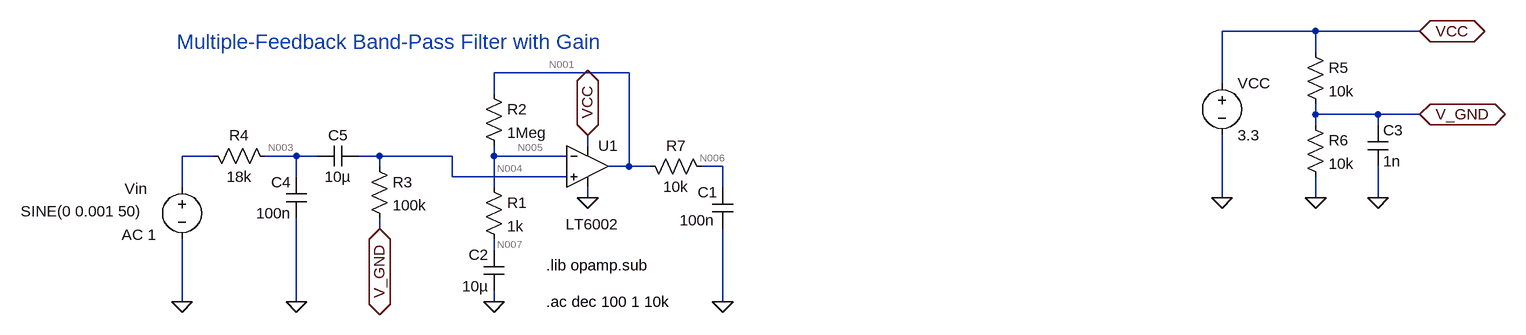
[diagram p0: schematic MF_bandpass.asc]
* MF_bandpass.asc
Vin N002 0 SINE(0 0.001 50) AC 1
R4 N003 N002 18k
C4 0 N003 100n
* U1: LT6002 (symbol Opamps\LT6002 not available, pins judged from their places): In+=N004 In-=N005 V+=VCC V-=0 OUT=N001
VCC VCC 0 3.3
R5 VCC V_GND 10k
R6 V_GND 0 10k
C3 V_GND 0 1n
C5 N004 N003 10µ
R1 N005 N007 1k
R2 N001 N005 1Meg
R7 N006 N001 10k
C1 0 N006 100n
R3 N004 V_GND 100k
C2 0 N007 10µ
.lib opamp.sub
.ac dec 100 1 10k
* Multiple-Feedback Band-Pass Filter with Gain
.backanno
.end

* Results of the author's LTspice run, read from the files saved beside the schematic
* Operating Point, zero values left out:
*   V(n005) = 1.65 V
*   V(n004) = 1.65 V
*   V(n001) = 1.648 V
*   V(vcc) = 3.3 V
*   V(v_gnd) = 1.65 V
*   V(n007) = 1.65 V
*   V(n006) = 1.648 V
*   I(R3) = 2.07 nA
*   I(R2) = -2.07 nA
*   I(R6) = 165 µA
*   I(R5) = 165 µA
*   I(Vcc) = -178 µA
*   Ix(u1:1) = -2.07 nA
*   Ix(u1:2) = -2.07 nA
*   Ix(u1:3) = 13 µA
*   Ix(u1:4) = -12.99 µA
*   Ix(u1:5) = 2.07 nA
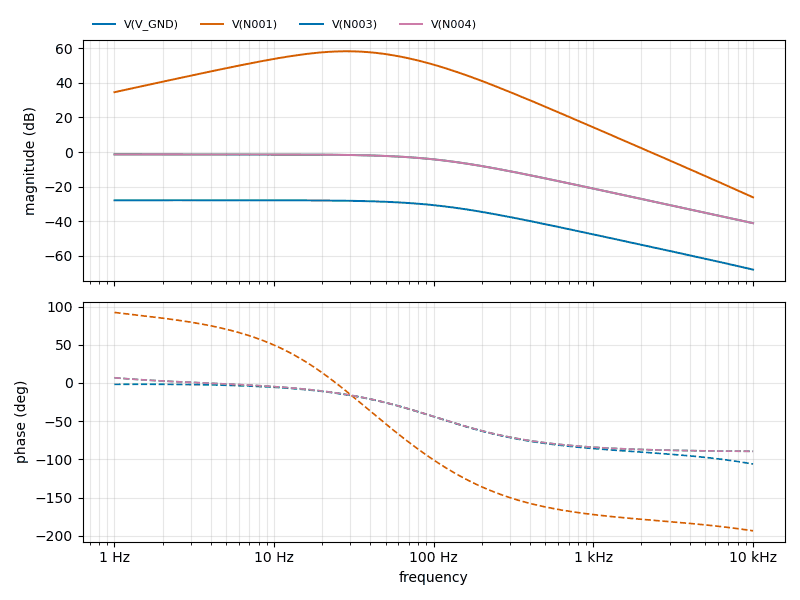
[diagram p1: AC Analysis of MF_bandpass.asc, plotted from the saved traces]
* AC Analysis, 1 run:
*   V(V_GND): -27.89 dB at 1 Hz, -67.89 dB at 10 kHz, peak -27.83 dB at 3.631 Hz, 3 dB below the peak at 103.8 Hz
*   V(N001): 34.52 dB at 1 Hz, -26.19 dB at 10 kHz, peak 58.15 dB at 28.18 Hz, 3 dB below the peak at 12.31 Hz and 61.24 Hz
*   V(N003): -1.35 dB at 1 Hz, -41.07 dB at 10 kHz, peak -1.35 dB at 1 Hz, 3 dB below the peak at 102.9 Hz
*   V(N004): -1.45 dB at 1 Hz, -41.07 dB at 10 kHz, peak -1.39 dB at 3.631 Hz, 3 dB below the peak at 103.8 Hz